# EAGLE board SBC_65C02_IRQ_BigBoard_v9-1-3 (EAGLE 9.6.2), part 1 of 2
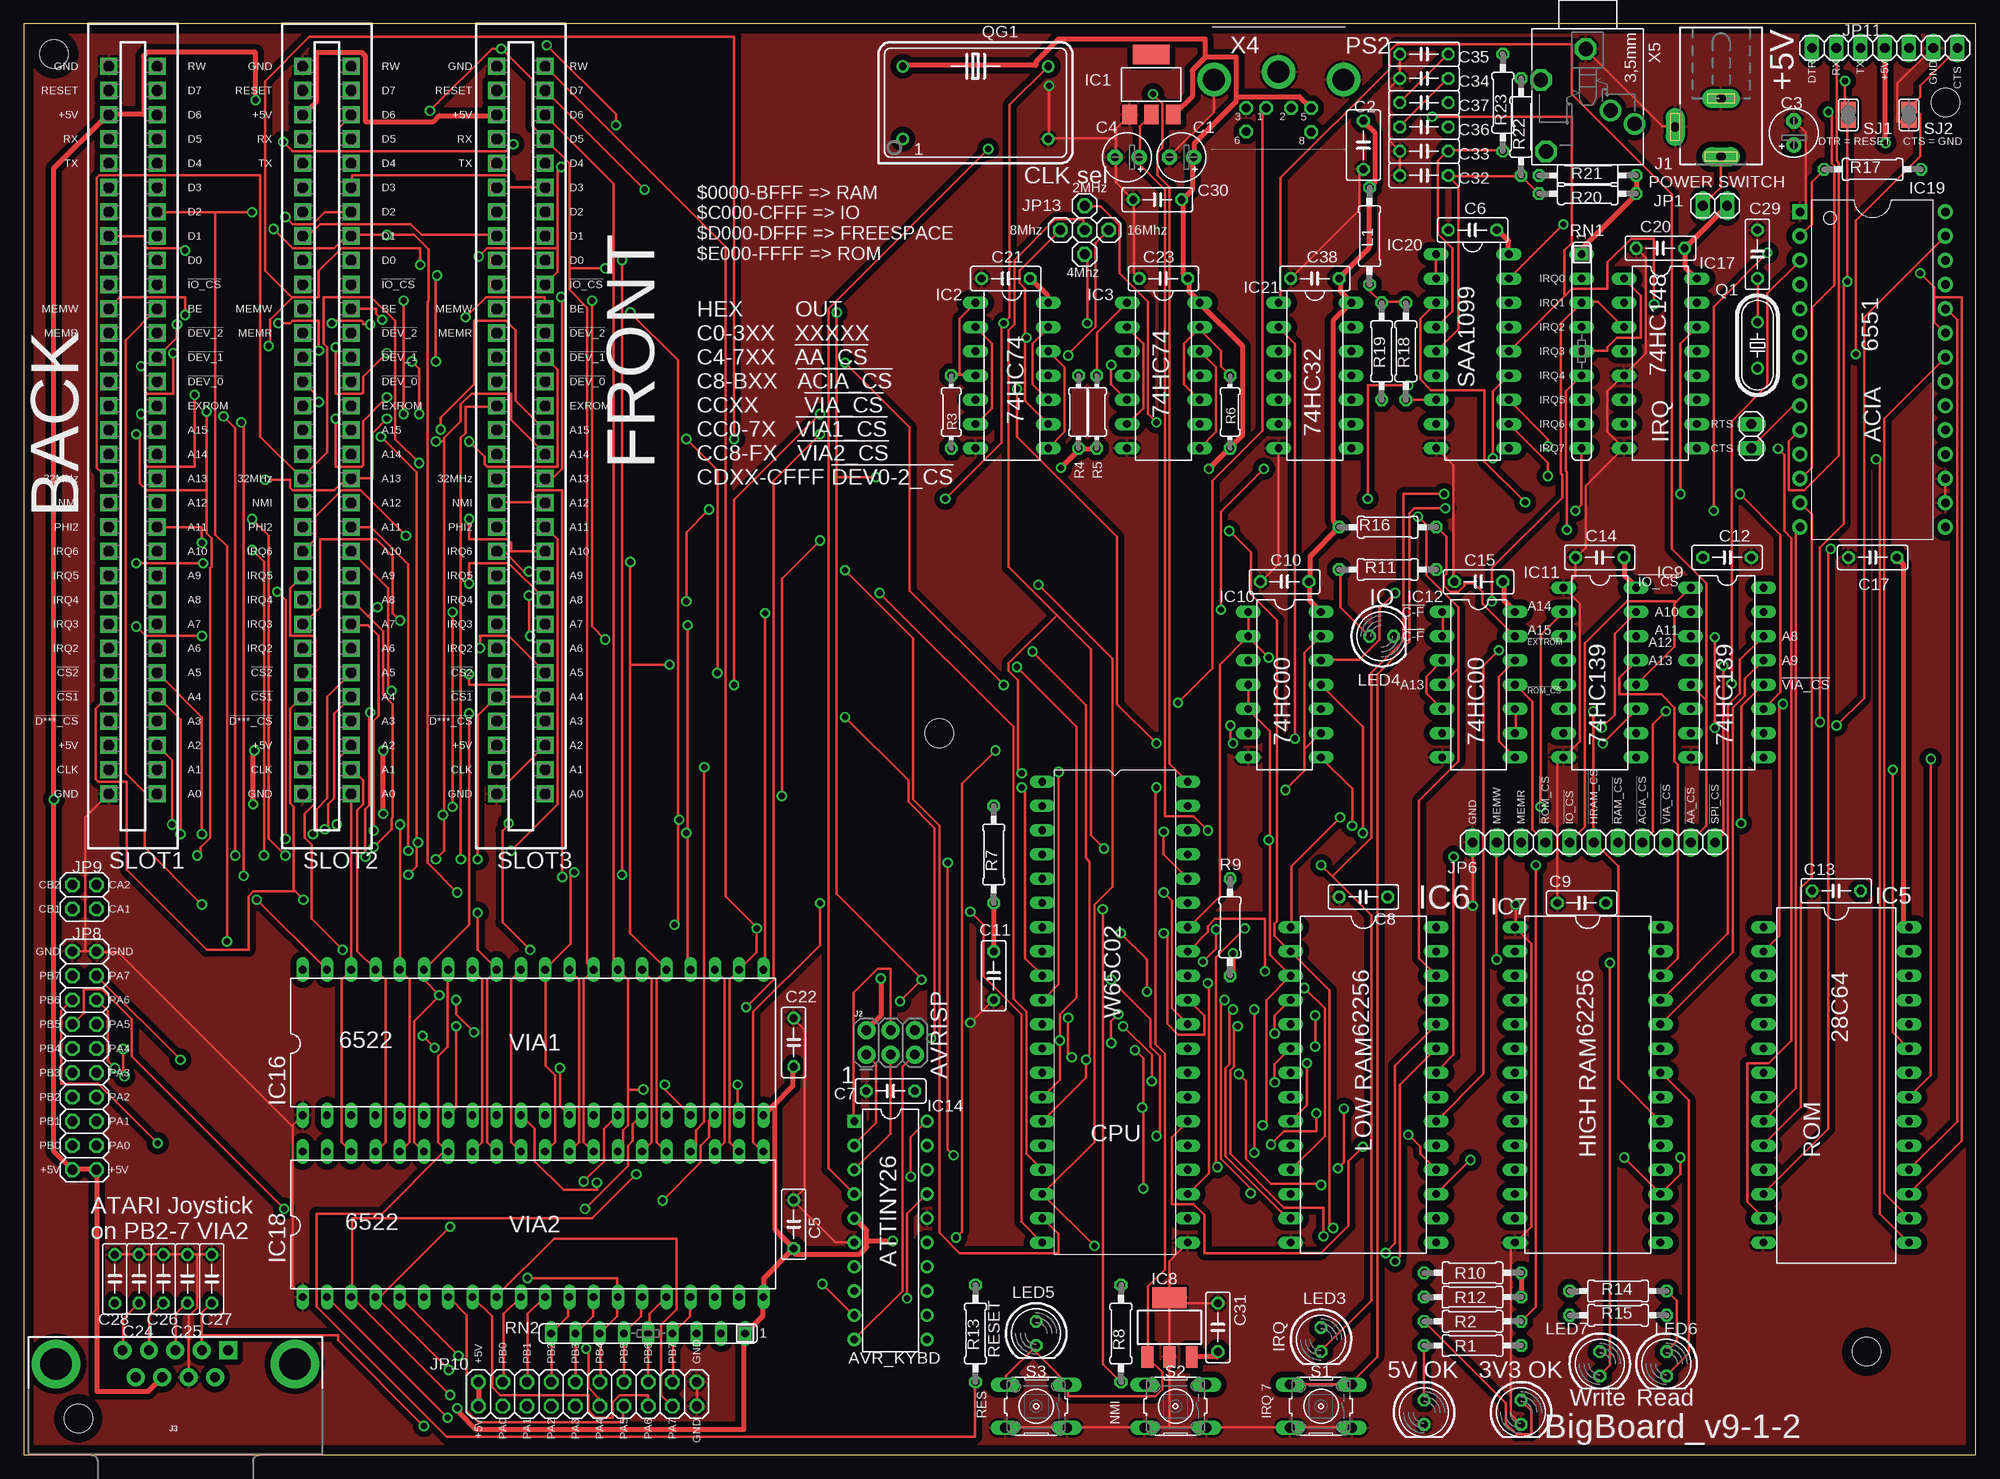
[diagram p7: board, top side]
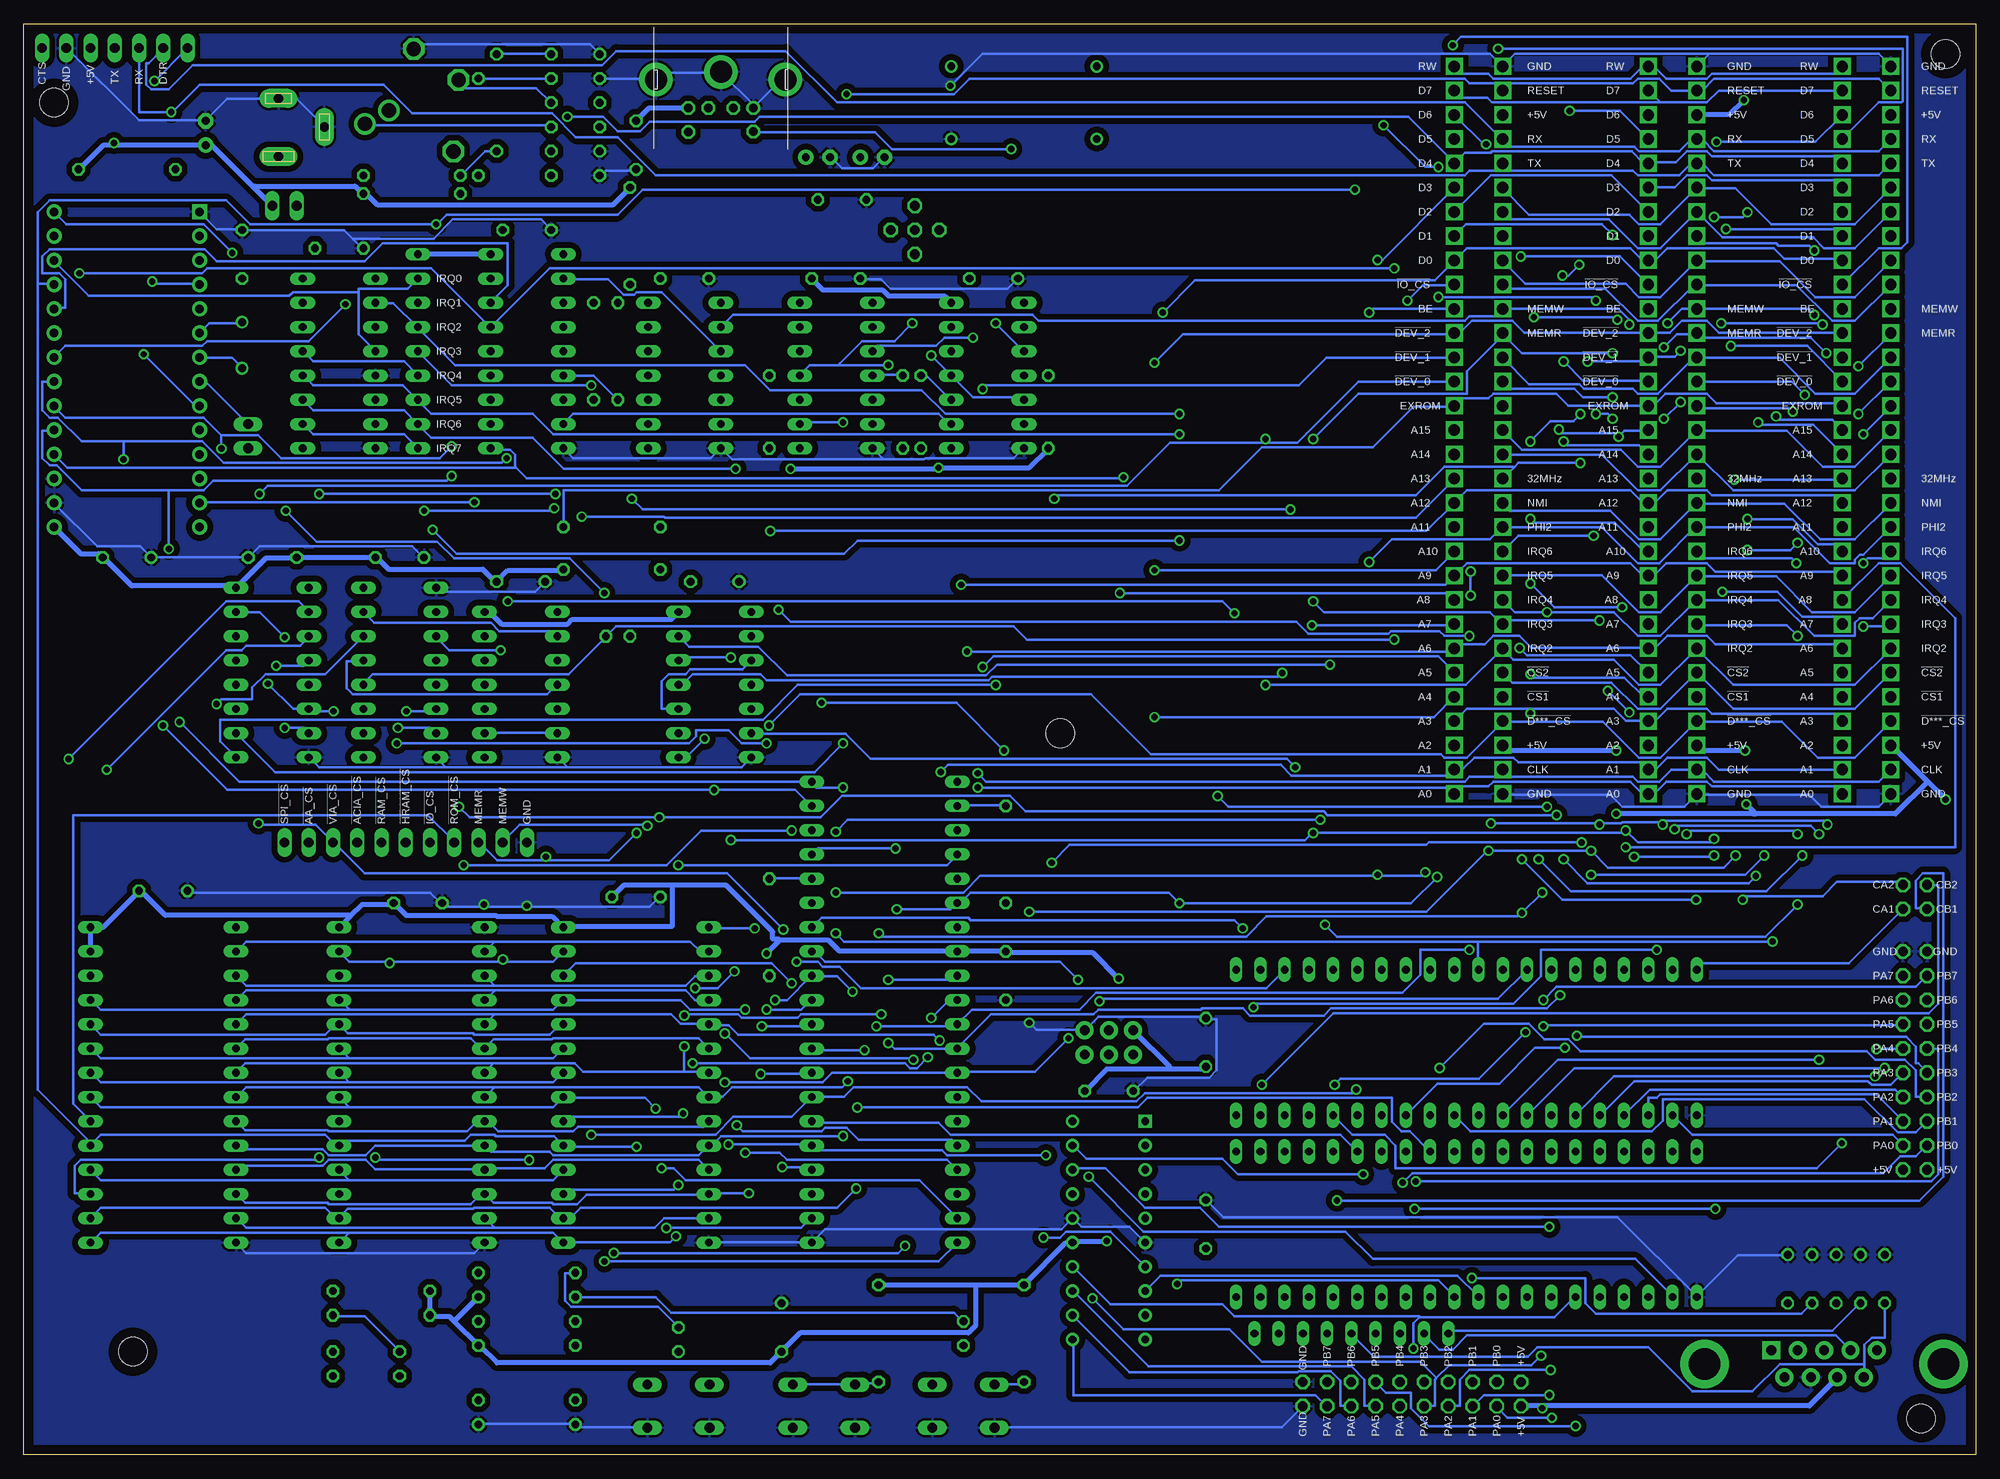
[diagram p8: board, bottom side, seen from below]

Size 204.47 x 149.86 mm. Coordinates in mm from the lower left corner, seen from the top.
Outline: 0,149.86 0,0 204.47,0 204.47,149.86 0,149.86
Copper layers (1*16): Top 0.035mm / dielectric 1.5mm / Bottom 0.035mm
Design rules "default": minimum track width 6mil, minimum drill 0.35mm, track to track 6mil, track to pad 6mil, pad to pad 6mil, via to via 6mil, smd to smd 6mil, copper to edge 40mil, drill to drill 6mil, minimum pad ring 10mil, minimum via ring 8mil, stop-mask expansion 4mil, vias tented up to drill 0mil, thermal gap 10mil
Net classes: 0 default: width 0.254 mm, drill 0.66 mm, clearance 0.203 mm; 1 power: width 0.508 mm, drill 0.66 mm, clearance 0.254 mm to class 0, clearance 0.254 mm
Holes 3 mm at 3.17,146.69 201.3,141.6 193.04,10.8 95.89,75.56 5.72,3.81
vRestrict: area 160.7,0.6 to 187.3,7

## Footprints (pad centres in the part's own frame; a part is rotated, then mirrored left to right if it is on the bottom)
E2,5-5 = drill 0.813 pad 1.6: + -1.27,0 | drill 0.813 pad 1.6 octagon: - 1.27,0
C050-035X075 = drill 0.813 octagon: 1 -2.54,0; 2 2.54,0
C050-025X075 = drill 0.813 octagon: 1 -2.54,0; 2 2.54,0
SOT223 = smd 1.499 x 2.007: 1 -2.261,-3.15; 2 0.025,-3.15; 3 2.311,-3.15 | smd 3.81 x 2.007: 4 0,3.15
DIL14 = drill 0.813 long: 1 -7.62,-3.81; 2 -5.08,-3.81; 3 -2.54,-3.81; 4 0,-3.81; 5 2.54,-3.81; 6 5.08,-3.81; 7 7.62,-3.81; 8 7.62,3.81; 9 5.08,3.81; 10 2.54,3.81; 11 0,3.81; 12 -2.54,3.81; 13 -5.08,3.81; 14 -7.62,3.81
DIL40 = drill 0.8 long: 1 -7.62,20.32; 2 -7.62,17.78; 3 -7.62,15.24; 4 -7.62,12.7; 5 -7.62,10.16; 6 -7.62,7.62; 7 -7.62,5.08; 8 -7.62,2.54; 9 -7.62,0; 10 -7.62,-2.54; 11 -7.62,-5.08; 12 -7.62,-7.62; 13 -7.62,-10.16; 14 -7.62,-12.7; 15 -7.62,-15.24; 16 -7.62,-17.78; 17 -7.62,-20.32; 18 -7.62,-22.86; 19 -7.62,-25.4; 20 -7.62,-27.94; 21 7.62,-27.94; 22 7.62,-25.4; 23 7.62,-22.86; 24 7.62,-20.32; 25 7.62,-17.78; 26 7.62,-15.24; 27 7.62,-12.7; 28 7.62,-10.16; 29 7.62,-7.62; 30 7.62,-5.08; 31 7.62,-2.54; 32 7.62,0; 33 7.62,2.54; 34 7.62,5.08; 35 7.62,7.62; 36 7.62,10.16; 37 7.62,12.7; 38 7.62,15.24; 39 7.62,17.78; 40 7.62,20.32
DIL28-6 = drill 0.813 long: 1 -16.51,-7.62; 2 -13.97,-7.62; 3 -11.43,-7.62; 4 -8.89,-7.62; 5 -6.35,-7.62; 6 -3.81,-7.62; 7 -1.27,-7.62; 8 1.27,-7.62; 9 3.81,-7.62; 10 6.35,-7.62; 11 8.89,-7.62; 12 11.43,-7.62; 13 13.97,-7.62; 14 16.51,-7.62; 15 16.51,7.62; 16 13.97,7.62; 17 11.43,7.62; 18 8.89,7.62; 19 6.35,7.62; 20 3.81,7.62; 21 1.27,7.62; 22 -1.27,7.62; 23 -3.81,7.62; 24 -6.35,7.62; 25 -8.89,7.62; 26 -11.43,7.62; 27 -13.97,7.62; 28 -16.51,7.62
SOT223' = smd 1.219 x 2.235: 1 -2.311,-3.099; 2 0,-3.099; 3 2.311,-3.099 | smd 3.6 x 2.2: 4 0,3.099
DIL16 = drill 0.813 long: 1 -8.89,-3.81; 2 -6.35,-3.81; 3 -3.81,-3.81; 4 -1.27,-3.81; 5 1.27,-3.81; 6 3.81,-3.81; 7 6.35,-3.81; 8 8.89,-3.81; 9 8.89,3.81; 10 6.35,3.81; 11 3.81,3.81; 12 1.27,3.81; 13 -1.27,3.81; 14 -3.81,3.81; 15 -6.35,3.81; 16 -8.89,3.81
DIL20 = drill 0.8 pad 1.4 square: 1 -11.43,-3.81 | drill 0.8 pad 1.4: 2 -8.89,-3.81; 3 -6.35,-3.81; 4 -3.81,-3.81; 5 -1.27,-3.81; 6 1.27,-3.81; 7 3.81,-3.81; 8 6.35,-3.81; 9 8.89,-3.81; 10 11.43,-3.81; 11 11.43,3.81; 12 8.89,3.81; 13 6.35,3.81; 14 3.81,3.81; 15 1.27,3.81; 16 -1.27,3.81; 17 -3.81,3.81; 18 -6.35,3.81; 19 -8.89,3.81; 20 -11.43,3.81
DIL40' = drill 0.813 long: 1 -24.13,-7.62; 2 -21.59,-7.62; 3 -19.05,-7.62; 4 -16.51,-7.62; 5 -13.97,-7.62; 6 -11.43,-7.62; 7 -8.89,-7.62; 8 -6.35,-7.62; 9 -3.81,-7.62; 10 -1.27,-7.62; 11 1.27,-7.62; 12 3.81,-7.62; 13 6.35,-7.62; 14 8.89,-7.62; 15 11.43,-7.62; 16 13.97,-7.62; 17 16.51,-7.62; 18 19.05,-7.62; 19 21.59,-7.62; 20 24.13,-7.62; 21 24.13,7.62; 22 21.59,7.62; 23 19.05,7.62; 24 16.51,7.62; 25 13.97,7.62; 26 11.43,7.62; 27 8.89,7.62; 28 6.35,7.62; 29 3.81,7.62; 30 1.27,7.62; 31 -1.27,7.62; 32 -3.81,7.62; 33 -6.35,7.62; 34 -8.89,7.62; 35 -11.43,7.62; 36 -13.97,7.62; 37 -16.51,7.62; 38 -19.05,7.62; 39 -21.59,7.62; 40 -24.13,7.62
DIP-28 = drill 0.889 pad 1.6 square: 1 -15.24,-7.62 | drill 0.889 pad 1.6: 2 -12.7,-7.62; 3 -10.16,-7.62; 4 -7.62,-7.62; 5 -5.08,-7.62; 6 -2.54,-7.62; 7 0,-7.62; 8 2.54,-7.62; 9 5.08,-7.62; 10 7.62,-7.62; 11 10.16,-7.62; 12 12.7,-7.62; 13 15.24,-7.62; 14 17.78,-7.62; 15 17.78,7.62; 16 15.24,7.62; 17 12.7,7.62; 18 10.16,7.62; 19 7.62,7.62; 20 5.08,7.62; 21 2.54,7.62; 22 0,7.62; 23 -2.54,7.62; 24 -5.08,7.62; 25 -7.62,7.62; 26 -10.16,7.62; 27 -12.7,7.62; 28 -15.24,7.62
DIL18 = drill 0.813 long: 1 -10.16,-3.81; 2 -7.62,-3.81; 3 -5.08,-3.81; 4 -2.54,-3.81; 5 0,-3.81; 6 2.54,-3.81; 7 5.08,-3.81; 8 7.62,-3.81; 9 10.16,-3.81; 10 10.16,3.81; 11 7.62,3.81; 12 5.08,3.81; 13 2.54,3.81; 14 0,3.81; 15 -2.54,3.81; 16 -5.08,3.81; 17 -7.62,3.81; 18 -10.16,3.81
DCJ0202 = drill 1 pad 2 long: 1 0,3.1; 2 4.8,0; 3 0,-3
2X3-NS = drill 1.016 pad 1.88: 1 -2.54,-1.27; 2 -2.54,1.27; 3 0,-1.27; 4 0,1.27; 5 2.54,-1.27; 6 2.54,1.27
DB9_MALE = drill 1.016 pad 1.88: 1 5.54,-1.42; 2 2.77,-1.42; 3 0,-1.42; 4 -2.77,-1.42; 6 4.15,1.42; 7 1.38,1.42; 8 -1.38,1.42; 9 -4.15,1.42 | drill 1.016 pad 1.88 square: 5 -5.54,-1.42 | drill 3.302 pad 5.08: G1 -12.5,0; G2 12.5,0
1X02 = drill 1.016 long: 1 -1.27,0; 2 1.27,0
1X01 = drill 1.016 octagon: 1 0,0
1X11 = drill 1.016 long: 1 -12.7,0; 2 -10.16,0; 3 -7.62,0; 4 -5.08,0; 5 -2.54,0; 6 0,0; 7 2.54,0; 8 5.08,0; 9 7.62,0; 10 10.16,0; 11 12.7,0
2X10 = drill 1.016 octagon: 1 -11.43,-1.27; 2 -11.43,1.27; 3 -8.89,-1.27; 4 -8.89,1.27; 5 -6.35,-1.27; 6 -6.35,1.27; 7 -3.81,-1.27; 8 -3.81,1.27; 9 -1.27,-1.27; 10 -1.27,1.27; 11 1.27,-1.27; 12 1.27,1.27; 13 3.81,-1.27; 14 3.81,1.27; 15 6.35,-1.27; 16 6.35,1.27; 17 8.89,-1.27; 18 8.89,1.27; 19 11.43,-1.27; 20 11.43,1.27
2X02 = drill 1.016 octagon: 1 -1.27,-1.27; 2 -1.27,1.27; 3 1.27,-1.27; 4 1.27,1.27
1X07 = drill 1.016 long: 1 -7.62,0; 2 -5.08,0; 3 -2.54,0; 4 0,0; 5 2.54,0; 6 5.08,0; 7 7.62,0
0207/10 = drill 0.813 octagon: 1 -5.08,0; 2 5.08,0
LED5MM = drill 0.813 octagon: A -1.27,0; K 1.27,0
HC49/S = drill 0.813: 1 -2.413,0; 2 2.413,0
DIL14S = drill 0.813: 1 -7.62,-3.81; 7 7.62,-3.81; 8 7.62,3.81; 14 -7.62,3.81
0204/7 = drill 0.813 octagon: 1 -3.81,0; 2 3.81,0
SIL9 = drill 0.813 long: 1 -10.16,0; 2 -7.62,0; 3 -5.08,0; 4 -2.54,0; 5 0,0; 6 2.54,0; 7 5.08,0; 8 7.62,0; 9 10.16,0
B3F-10XX = drill 1.016 long: 1 -3.251,2.261; 2 3.251,2.261; 3 -3.251,-2.261; 4 3.251,-2.261
SJ = smd 1.168 x 1.6: 1 -0.762,0; 2 0.762,0
ISA-8 = drill 1.2 pad 1.778 square: A1 40.64,-2.54; A2 38.1,-2.54; A3 35.56,-2.54; A4 33.02,-2.54; A5 30.48,-2.54; A6 27.94,-2.54; A7 25.4,-2.54; A8 22.86,-2.54; A9 20.32,-2.54; A10 17.78,-2.54; A11 15.24,-2.54; A12 12.7,-2.54; A13 10.16,-2.54; A14 7.62,-2.54; A15 5.08,-2.54; A16 2.54,-2.54; A17 0,-2.54; A18 -2.54,-2.54; A19 -5.08,-2.54; A20 -7.62,-2.54; A21 -10.16,-2.54; A22 -12.7,-2.54; A23 -15.24,-2.54; A24 -17.78,-2.54; A25 -20.32,-2.54; A26 -22.86,-2.54; A27 -25.4,-2.54; A28 -27.94,-2.54; A29 -30.48,-2.54; A30 -33.02,-2.54; A31 -35.56,-2.54; B1 40.64,2.54; B2 38.1,2.54; B3 35.56,2.54; B4 33.02,2.54; B5 30.48,2.54; B6 27.94,2.54; B7 25.4,2.54; B8 22.86,2.54; B9 20.32,2.54; B10 17.78,2.54; B11 15.24,2.54; B12 12.7,2.54; B13 10.16,2.54; B14 7.62,2.54; B15 5.08,2.54; B16 2.54,2.54; B17 0,2.54; B18 -2.54,2.54; B19 -5.08,2.54; B20 -7.62,2.54; B21 -10.16,2.54; B22 -12.7,2.54; B23 -15.24,2.54; B24 -17.78,2.54; B25 -20.32,2.54; B26 -22.86,2.54; B27 -25.4,2.54; B28 -27.94,2.54; B29 -30.48,2.54; B30 -33.02,2.54; B31 -35.56,2.54
M_DIN6 = drill 0.9 pad 1.422 octagon: 1 -1.3,-3.75; 2 1.3,-3.75; 3 -3.4,-3.75; 5 3.4,-3.75; 6 -3.4,-6.2; 8 3.4,-6.25 | drill 2.3 pad 3.5: SH1 6.8,-0.75; SH2 0,0.05; SH3 -6.75,-0.75
PG203J = drill 1.499 octagon: 1 -5.004,-0.203; 4 5.74,-4.369; 5 -1.753,-4.902 | drill 1.499: 2 2.845,4.902; 3 1.448,2.388

## Placement (x,y rotation side)
C1  10uF  [E2,5-5]  121.28,135.89 180 top
C2  [C050-035X075]  140.34,137.16 270 top
C3  [E2,5-5]  185.42,138.43 90 top
C4  100uF  [E2,5-5]  115.57,135.89 180 top
C5  [C050-025X075]  80.64,24.13 90 top
C6  [C050-025X075]  151.76,128.27 180 top
C7  [C050-025X075]  90.81,38.1 180 top
C8  [C050-025X075]  140.34,58.42 180 top
C9  [C050-025X075]  163.19,57.78 0 top
C10  [C050-025X075]  132.08,91.44 180 top
C11  [C050-025X075]  101.6,50.17 270 top
C12  [C050-025X075]  178.44,93.98 0 top
C13  [C050-025X075]  189.87,59.06 180 top
C14  [C050-025X075]  165.1,93.98 180 top
C15  [C050-025X075]  152.4,91.44 180 top
C17  [C050-025X075]  193.68,93.98 0 top
C20  [C050-025X075]  171.45,126.37 180 top
C21  [C050-025X075]  102.87,123.19 180 top
C22  [C050-025X075]  80.64,43.18 90 top
C23  [C050-025X075]  119.38,123.19 180 top
C24  1n  [C050-025X075]  12.06,18.41 270 top
C25  1n  [C050-025X075]  17.14,18.41 90 top
C26  1n  [C050-025X075]  14.61,18.41 270 top
C27  1n  [C050-025X075]  19.69,18.41 90 top
C28  1n  [C050-025X075]  9.53,18.41 270 top
C29  [C050-025X075]  181.61,125.73 270 top
C30  [C050-025X075]  118.75,131.44 0 top
C31  [C050-025X075]  125.09,13.34 270 top
C32  10n  [C050-025X075]  146.69,133.99 0 top
C33  10n  [C050-025X075]  146.69,136.53 0 top
C34  10n  [C050-025X075]  146.69,144.15 0 top
C35  10n  [C050-025X075]  146.69,146.69 0 top
C36  100n  [C050-025X075]  146.69,139.06 0 top
C37  100n  [C050-025X075]  146.69,141.6 0 top
C38  [C050-025X075]  135.25,123.19 180 top
IC1  REG1117_3V3  [SOT223]  118.11,143.51 0 top
IC2  74HC74N  [DIL14]  103.5,113.03 270 top
IC3  74HC74N  [DIL14]  119.38,113.03 270 top
IC4  W65C02SP  [DIL40]  114.3,50.17 0 top
IC5  28C64AP  [DIL28-6]  189.87,38.73 270 top
IC6  62256  [DIL28-6]  140.34,38.73 270 top
IC7  62256  [DIL28-6]  163.83,38.73 270 top
IC8  DS1233  [SOT223']  120.02,13.34 0 top
IC9  74HCT139N  [DIL16]  178.44,81.92 270 top
IC10  74AC00N  [DIL14]  132.08,80.64 270 top
IC11  74HCT139N  [DIL16]  165.1,81.92 270 top
IC12  74AC00N  [DIL14]  152.4,80.64 270 top
IC14  ATTINY26-16PU  [DIL20]  90.81,23.49 270 top
IC16  [DIL40']  53.34,43.18 0 top
IC17  74HC148N  [DIL16]  171.45,114.3 270 top
IC18  [DIL40']  53.34,24.13 0 top
IC19  R6551  [DIP-28]  193.68,114.94 270 top
IC20  SAA  [DIL18]  151.76,115.57 270 top
IC21  74AC32N  [DIL14]  135.25,113.03 270 top
J1  DCJ0202  [DCJ0202]  177.8,139.06 180 top
J2  AVR_SPI_PROG_3X2NS  [2X3-NS]  90.81,43.18 0 top
J3  [DB9_MALE]  15.88,9.52 180 top
JP1  [1X02]  177.17,130.81 0 top
JP2  [1X01]  113.66,128.27 0 top
JP3  [1X01]  108.59,128.27 0 top
JP4  [1X01]  111.12,125.73 0 top
JP5  [1X01]  111.12,130.81 0 top
JP6  [1X11]  164.47,64.14 0 top
JP8  Parallel  [2X10]  6.35,41.27 90 top
JP9  Timer_OUT  [2X02]  6.35,58.42 90 top
JP10  Parallel2  [2X10]  59.05,6.35 0 top
JP11  [1X07]  194.94,147.32 0 top
JP12  [1X02]  180.97,106.68 270 top
JP13  [1X01]  111.12,128.27 0 top
L1  [0207/10]  140.97,127.63 270 top
LED1  [LED5MM]  146.69,4.45 270 top
LED2  [LED5MM]  156.84,4.45 270 top
LED3  [LED5MM]  135.89,12.07 270 top
LED4  [LED5MM]  142.24,85.72 0 top
LED5  [LED5MM]  106.05,12.7 270 top
LED6  [LED5MM]  172.09,9.52 270 top
LED7  [LED5MM]  165.1,9.52 270 top
Q1  1,8432MHz  [HC49/S]  181.61,116.21 270 top
QG1  32Mhz  [DIL14S]  99.69,141.6 0 top
R1  680R  [0207/10]  151.76,11.43 0 top
R2  470R  [0207/10]  151.76,13.97 0 top
R3  4k7  [0204/7]  97.16,109.22 90 top
R4  4k7  [0204/7]  110.49,109.22 90 top
R5  4k7  [0204/7]  112.39,109.22 90 top
R6  4k7  [0204/7]  126.37,109.22 90 top
R7  22k  [0207/10]  101.6,62.86 90 top
R8  22k  [0207/10]  114.94,12.7 270 top
R9  22k  [0207/10]  126.37,55.25 90 top
R10  680R  [0207/10]  151.76,19.05 0 top
R11  680R  [0207/10]  142.88,92.71 0 top
R12  680R  [0207/10]  151.76,16.51 0 top
R13  22k  [0207/10]  99.69,12.7 270 top
R14  680R  [0207/10]  167,17.15 0 top
R15  680R  [0207/10]  167,14.61 0 top
R16  22K  [0207/10]  142.88,97.16 180 top
R17  22k  [0207/10]  193.68,134.62 0 top
R18  22k  [0207/10]  144.78,115.57 90 top
R19  22k  [0207/10]  142.24,115.57 90 top
R20  1k  [0207/10]  163.83,132.08 180 top
R21  1k  [0207/10]  163.83,133.99 180 top
R22  1k  [0207/10]  156.84,139.06 90 top
R23  1k  [0207/10]  154.94,141.6 90 top
RN1  22k  [SIL9]  163.19,115.57 270 top
RN2  22k  [SIL9]  65.41,12.7 180 top
S1  [B3F-10XX]  135.89,5.08 180 top
S2  [B3F-10XX]  120.65,5.08 180 top
S3  [B3F-10XX]  106.05,5.08 180 top
SJ1  [SJ]  191.13,140.34 90 top
SJ2  [SJ]  197.49,140.34 90 top
X1  [ISA-8]  11.43,104.78 90 top
X2  [ISA-8]  31.75,104.78 90 top
X3  [ISA-8]  52.07,104.78 90 top
X4  [M_DIN6]  131.44,144.78 0 top
X5  PG203J  [PG203J]  163.83,142.24 270 top

## Tracks (layer width: path | path; a pad name or v marks a point on that pad's centre or on a via)
2MHZ  (via drill 0.66)
  Top 0.254: v118.66,108.12 117.78,109 117.78,120.75 114.78,123.75 114.78,128.75 112.78,130.75 111.16,130.75 JP5.1
  Bottom 0.254: v118.66,108.12 123.03,108.12 123.16,108 IC3.9
2PA0  (via drill 0.66)
  Top 0.254: v44.41,3.88 31.78,16.5 IC18.2 | v92.91,29.12 92.91,33.25 94.53,34.88 IC14.20
  Bottom 0.254: v44.41,3.88 49.03,3.88 50.16,5 JP10.3 | v92.91,29.12 87.16,23.38 66.03,23.38 63.16,20.5 35.66,20.5 31.78,16.62 IC18.2
2PA1  (via drill 0.66)
  Top 0.254: v44.66,6.25 34.41,16.5 IC18.3 34.41,16.62 34.41,24.75 59.53,24.75 v64.16,29.38
  Bottom 0.254: v44.66,6.25 51.53,6.25 52.66,5.12 JP10.5 | v64.16,29.38 77.28,29.38 78.91,31 93.16,31 94.53,32.38 IC14.19
2PA2  (via drill 0.66)
  Top 0.254: v44.53,8.88 36.91,16.5 IC18.4 37.16,16.38 v44.66,23.88
  Bottom 0.254: v44.53,8.88 53.03,8.88 54.03,7.88 54.03,5.12 55.16,5.12 JP10.7 | v44.66,23.88 79.28,23.88 81.28,25.88 87.03,25.88 91.16,30 94.41,30 94.53,29.88 IC14.18
2PA3  (via drill 0.66)
  Top 0.254: v45.53,10.38 39.41,16.5 IC18.5 | v92.53,16.38 92.53,25.25 94.53,27.25 IC14.17
  Bottom 0.254: v45.53,10.38 46.53,9.38 55.16,9.38 56.47,8.06 | 56.47,8.06 56.66,7.88 56.66,5.12 57.78,5.12 JP10.9 | v92.53,16.38 89.28,13.12 78.16,13.12 74.78,9.75 58.16,9.75 56.47,8.06
2PA4  (via drill 0.66)
  Top 0.254: v58.91,11.12 59.16,10.88 59.16,7 60.28,5.88 60.28,5.12 JP10.11
  Bottom 0.254: 58.28,14.38 44.16,14.38 42.03,16.5 IC18.6 | 58.28,14.38 58.91,13.75 v58.91,11.12 | IC14.14 94.53,19.62 90.66,15.75 78.91,15.75 77.66,14.5 58.28,14.5 58.28,14.38
2PA5
  Top 0.254: IC18.7 44.53,16.5 46.41,14.62 46.41,4.62 47.66,3.38 62.78,3.38 62.78,5 JP10.13
  Bottom 0.254: IC14.13 94.53,17.12 86.66,9.25 65.41,9.25 64.03,7.88 64.03,5.12 62.91,5.12 JP10.13
2PA6
  Top 0.254: JP10.15 65.41,6.25 62.41,6.25 61.66,5.5 61.66,3.88 59.91,3.88 59.16,4.62 59.16,6.25 49.91,6.25 49.03,7.12 49.03,14.5 47.03,16.5 IC18.8
  Bottom 0.254: IC14.12 94.53,14.5 88.66,8.62 71.03,8.62 70.91,8.75 67.53,8.75 66.53,7.75 66.53,5.12 65.41,5.12 JP10.15
2PA7
  Top 0.254: IC18.9 49.53,16.62 55.53,22.62 68.41,22.62 68.41,15.25 66.78,13.62 66.78,6.25 67.91,5.12 JP10.17
  Bottom 0.254: IC14.11 94.53,12 94.53,6.25 69.16,6.25 68.03,5.12 JP10.17
2PB0
  Top 0.254: IC18.10 52.03,16.5 50.28,14.75 50.28,7.62 JP10.4
  Bottom 0.254: IC14.8 86.91,17.25 85.41,18.75 54.28,18.75 52.16,16.62 IC18.10
2PB1  (via drill 0.66)
  Top 0.254: IC18.11 54.53,16.5 52.78,14.75 52.78,7.62 JP10.6 | v83.66,17.88 86.91,14.62 IC14.9
  Bottom 0.254: v83.66,17.88 83.28,18.25 56.28,18.25 54.66,16.62 IC18.11
2PB2
  Top 0.254: C24.2 12.03,15.88 10.41,14.25 10.41,11 J3.1 | IC18.12 57.03,16.5 57.03,14.5 55.28,12.75 RN2.9 55.28,12.62 55.28,7.62 JP10.8
  Bottom 0.254: C24.2 12.16,15.88 15.03,13 54.91,13 55.16,12.75 RN2.9
2PB3
  Top 0.254: C26.2 14.53,15.88 13.16,14.5 13.16,11 J3.2 | IC18.13 59.66,16.5 59.66,14.5 57.91,12.75 RN2.8 57.78,12.62 JP10.10
  Bottom 0.254: J3.2 13.16,11 14.66,12.5 53.28,12.5 54.78,11 56.16,11 57.78,12.62 RN2.8
2PB4  (via drill 0.66)
  Top 0.254: C25.1 17.03,15.88 15.91,14.75 15.91,11 J3.3 | JP10.12 60.41,7.62 60.41,12.62 RN2.7 60.41,12.75 62.16,14.5 62.16,16.5 IC18.14 62.16,16.62 62.16,18.5 v52.78,18.5
  Bottom 0.254: v52.78,18.5 40.91,18.5 40.91,15.88 39.78,14.75 18.28,14.75 17.16,15.88 C25.1
2PB5  (via drill 0.66)
  Top 0.254: 18.66,12.5 18.66,11 J3.4 | 18.66,12.5 18.66,14.88 19.66,15.88 C27.1 | IC18.15 64.66,16.5 64.66,14.5 62.91,12.75 RN2.6 62.91,12.62 62.91,7.62 JP10.14 | 18.66,12.5 32.91,12.5 32.91,12 v41.91,3
  Bottom 0.254: v41.91,3 57.28,3 59.16,4.88 59.16,6.5 61.78,6.5 62.78,7.5 JP10.14
2PB6
  Top 0.254: JP10.16 RN2.5 65.53,12.75 65.53,14.75 67.28,16.5 IC18.16
  Bottom 0.254: 11.66,9.5 11.66,8.12 J3.6 | 11.66,9.5 11.66,11.5 10.91,12.25 9.53,12.25 C28.2 | 11.66,9.5 20.53,9.5 23.41,6.62 29.66,6.62 34.28,11.25 45.91,11.25 46.91,10.25 63.03,10.25 65.41,12.62 RN2.5
2PB7
  Top 0.254: IC18.17 69.78,16.5 69.78,14.5 68.03,12.75 RN2.4 68.03,12.62 68.03,7.62 JP10.18
4MHZ  (via drill 0.66)
  Top 0.254: v113.91,114.12 113.91,112.12 115.53,110.5 IC3.5 | v111.41,118.5 111.41,125.38 111.16,125.62 JP4.1
  Bottom 0.254: 119.03,114.12 122.16,114.12 123.16,113.12 IC3.11 | 119.03,114.12 v113.91,114.12 | v111.41,118.5 113.28,116.62 116.66,116.62 119.03,114.25 119.03,114.12
8MHZ  (via drill 0.66)
  Top 0.254: 104.91,117 104.91,122.12 104.28,122.75 104.28,124 108.53,128.25 JP3.1 | 104.91,117 104.91,110.38 107.28,108 IC2.9 | v105.03,117 104.91,117
  Bottom 0.254: IC20.8 146.91,109 108.66,109 107.66,108 107.41,108 IC2.9 | v105.03,117 108.03,117 108.91,116.12 115.03,116.12 115.53,115.62 IC3.3
16MHZ  (via drill 0.66)
  Top 0.254: v109.41,115.12 109.41,115.25 112.28,118.12 112.28,126.88 113.66,128.25 JP2.1
  Bottom 0.254: IC2.5 99.78,110.5 100.03,110.75 105.03,110.75 107.28,113 IC2.11 107.41,113.12 v109.41,115.12
32MHZ  (via drill 0.66)
  Top 0.254: QG1.8 107.28,145.38 103.28,141.38 103.28,119.12 v102.66,118.5 102.66,118.38 102.41,118.12 102.41,106 v96.53,100.12 | X1.B18 8.78,102.25 7.66,103.38 7.66,133.75 7.91,134 24.78,134 24.78,106.62 29.16,102.25 X2.B18 29.16,102.38 31.78,105 31.78,116 31.41,116.38 31.41,121.25 36.41,121.25 38.91,118.75 38.91,106.38 v41.41,103.88
  Bottom 0.254: v102.66,118.5 99.78,115.62 IC2.3 | 48.34,103.44 47.91,103.88 v41.41,103.88 | 48.34,103.44 49.53,102.25 X3.B18 | v96.53,100.12 96.16,100.5 58.66,100.5 55.66,103.5 48.41,103.5 48.34,103.44
!A7  (via drill 0.66)
  Top 0.254: v71.28,72 71.28,34.88 70.41,34 70.41,32.25 69.91,31.75 IC18.24
  Bottom 0.254: v71.28,72 72.16,72.88 115.78,72.88 118.41,75.5 128.16,75.5 IC10.6
!AA_CS
  Top 0.254: 176.22,79.06 176.28,79 176.28,65.88 174.66,64.25 JP6.10 | 176.22,79.06 174.66,80.62 IC9.5 | IC21.1 131.53,120.75 131.66,120.88 131.66,133.75 143.03,145.12 143.03,147 143.78,147.75 162.16,147.75 162.16,142.5 172.66,132 172.66,94.88 176.28,91.25 176.28,79.12 176.22,79.06
!AA_CS_WR
  Top 0.254: IC20.1 147.91,125.62 147.91,123.25 IC20.2
  Bottom 0.254: IC21.3 131.53,115.62 137.66,121.75 140.28,121.75 140.53,121.5 141.66,121.5 143.28,123.12 147.91,123.12 IC20.2
!ACIA_CS  (via drill 0.66)
  Top 0.254: v172.03,77.88 170.66,76.5 170.66,65.25 169.66,64.25 JP6.8 | v178.91,80.75 178.91,108.25 182.66,112 182.66,121.62 186.03,125 IC19.3
  Bottom 0.254: v172.03,77.88 174.41,77.88 174.53,78 IC9.6 174.66,78.12 176.28,78.12 v178.91,80.75
!C-F  (via drill 0.66)
  Top 0.254: IC12.2 148.66,85.75 148.66,88.25 IC12.1 | v165.28,76.12 166.66,77.5 166.66,86 168.91,88.25 IC11.15
  Bottom 0.254: v165.28,76.12 161.91,76.12 161.41,75.62 IC11.7 | IC12.2 148.66,85.75 149.16,86.25 154.66,86.25 155.53,87.12 167.78,87.12 168.91,88.25 IC11.15
!D_CS  (via drill 0.66)
  Top 0.254: v165.41,74.5 168.91,78 IC11.11 | v126.66,74.5 126.41,74.75 v126.41,76.38
  Bottom 0.254: X1.B28 8.91,76.75 12.66,73 16.53,73 20.28,76.75 29.16,76.75 X2.B28 29.28,76.75 33.03,73 35.28,73 39.03,76.75 49.41,76.75 X3.B28 49.53,76.75 53.28,73 55.66,73 56.03,73.38 86.41,73.38 92.66,79.62 123.16,79.62 v126.41,76.38 | v165.41,74.5 134.78,74.5 134.03,75.25 134.03,75.88 130.66,75.88 129.28,74.5 v126.66,74.5
!DEV0_CS  (via drill 0.66)
  Top 0.254: v25.66,116.12 25.78,116.25 25.78,118.88 28.09,121.19 | 28.09,121.19 28.16,121.25 30.91,121.25 30.91,124 33.28,126.38 41.53,126.38 v41.53,124.62 | v43.28,123.5 43.16,123.38 v43.16,114.5 | v179.78,100.62 184.03,96.38 184.03,79.88 182.28,78.12 IC9.11 | 28.09,121.19 25.28,124 25.28,143.88 29.91,148.5 74.41,148.5 v74.41,106.38
  Bottom 0.254: v25.66,116.12 17.66,116.12 14.03,112.5 X1.A14 | v41.53,124.62 42.66,123.5 v43.28,123.5 | v43.16,114.5 41.16,112.5 34.41,112.5 X2.A14 | v179.78,100.62 178.91,101.5 88.91,101.5 84.41,106 74.41,106 | 74.41,106 71.03,106 64.66,112.38 54.66,112.38 X3.A14 | 74.41,106 v74.41,106.38
!DEV1_CS  (via drill 0.66)
  Top 0.254: v16.03,118.38 16.03,117 14.03,115 X1.A13 | v26.66,118.5 27.91,118.5 28.16,118.75 30.91,118.75 v30.91,115.62 | v118.66,74.5 114.53,78.62 114.53,96.12 104.03,106.62 v104.03,111.62 | v40.66,114.5 41.41,113.75 v41.41,109 | v46.66,106.12 48.28,104.5 48.28,103.75 48.53,103.5 55.91,103.5 55.91,113.62 54.66,114.88 X3.A13
  Bottom 0.254: v16.03,118.38 16.16,118.5 v26.66,118.5 | v30.91,115.62 31.53,115 34.28,115 X2.A13 34.41,114.88 34.78,114.5 v40.66,114.5 | v118.66,74.5 121.66,71.5 178.16,71.5 182.16,75.5 IC9.10 | v104.03,111.62 103.66,112 70.91,112 68.03,114.88 54.66,114.88 X3.A13 | v41.41,109 42.16,108.25 44.53,108.25 v46.66,106.12
!DEV2_CS  (via drill 0.66)
  Top 0.254: v102.66,80.62 92.78,90.5 92.78,107.62 v86.03,114.38
  Bottom 0.254: X1.A12 14.03,117.5 26.91,117.5 28.16,118.75 30.78,118.75 32.03,117.5 34.28,117.5 X2.A12 34.41,117.5 47.28,117.5 48.53,118.75 52.78,118.75 54.03,117.5 54.53,117.5 X3.A12 54.66,117.38 83.03,117.38 v86.03,114.38 | v102.66,80.62 123.41,80.62 127.03,77 183.91,77 183.91,74.75 182.28,73.12 IC9.9
!E-F
  Top 0.254: IC12.10 156.28,78 156.28,75.62 IC12.9
  Bottom 0.254: IC12.6 148.66,75.62 156.16,75.62 IC12.9
!EXROM
  Top 0.254: IC12.13 156.16,85.75 152.78,89.12 152.78,90.38 151.91,91.25 150.91,91.25 150.91,91 150.28,90.38 149.41,90.38 148.78,91 148.78,92 149.03,92.25 149.03,96.12 148.03,97.12 R16.1
  Bottom 0.254: X1.A15 14.03,109.88 14.28,110.12 27.16,110.12 28.16,111.12 32.53,111.12 33.78,109.88 34.28,109.88 X2.A15 34.41,109.88 42.66,109.88 43.91,111.12 50.53,111.12 51.03,110.62 53.78,110.62 54.53,109.88 X3.A15 54.66,109.75 58.91,109.75 63.16,105.5 74.78,105.5 79.28,101 147.91,101 147.91,97.25 R16.1
!HRAM_CS  (via drill 0.66)
  Top 0.254: IC7.20 171.41,35 167.03,39.38 167.03,61.62 164.53,64.12 JP6.6 164.41,64.25 v164.41,77.88
  Bottom 0.254: v164.41,77.88 161.53,77.88 161.41,78 IC11.6
!IO_CS  (via drill 0.66)
  Top 0.254: 173.09,89.31 174.53,90.75 IC9.1 | 173.09,89.31 172.91,89.12 172.91,84.62 169.03,80.75 IC11.12 | JP6.5 162.03,64.25 163.53,65.75 163.53,85 167.91,89.38 173.03,89.38 173.09,89.31 | v54.78,147.62 62.03,140.38 v62.03,139.25 | v56.28,134.88 55.91,134.5 55.91,126.38 | 55.91,126.38 55.91,123.88 54.66,122.62 X3.A10 | v47.66,125.5 48.53,126.38 55.91,126.38 | v60.91,85.38 59.53,86.75 v59.53,120.88
  Bottom 0.254: IC11.12 168.91,80.75 167.91,81.75 147.41,81.75 143.53,85.62 LED4.K 143.41,85.75 142.41,86.75 100.78,86.75 99.41,85.38 v60.91,85.38 | v54.78,147.62 53.91,148.5 7.16,148.5 7.16,127 7.78,126.38 10.16,126.38 13.91,122.62 X1.A10 | v62.03,139.25 57.66,134.88 v56.28,134.88 | v47.66,125.5 37.28,125.5 34.41,122.62 X2.A10 | v59.53,120.88 57.91,122.5 54.66,122.5 X3.A10
!MEMR  (via drill 0.66)
  Top 0.254: v12.28,114 12.66,113.62 12.66,111.38 12.91,111.12 15.66,111.12 v15.66,115.38 | v38.03,115.38 35.53,112.88 35.53,111.25 35.41,111.12 32.66,111.12 v32.66,116 | v140.28,65.12 140.28,76.25 135.91,80.62 IC10.11 | LED6.K 172.16,8.38 174.41,10.62 174.41,37.12 171.53,40 IC7.22 | v149.78,62.62 149.78,41.88 148.03,40.12 IC6.22 | v69.41,106.38 72.66,103.12 v72.66,81.88
  Bottom 0.254: v12.28,114 8.91,117.38 X1.B12 | v15.66,115.38 17.28,117 28.78,117 29.16,117.38 X2.B12 29.28,117.38 31.28,117.38 v32.66,116 | v38.03,115.38 47.53,115.38 49.53,117.38 X3.B12 49.53,117.25 53.28,113.5 53.28,111.12 64.66,111.12 v69.41,106.38 | v140.28,65.12 143.16,62.25 149.78,62.25 | 149.78,62.25 154.91,62.25 156.78,64.12 JP6.3 | 170.41,39 149.03,39 148.03,40 IC6.22 | 170.41,39 171.41,40 IC7.22 | 170.41,39 196.41,39 197.41,40 IC5.22 | v149.78,62.62 149.78,62.25 | v72.66,81.88 73.03,81.5 103.03,81.5 103.41,81.12 126.66,81.12 127.28,81.75 134.41,81.75 135.41,80.75 135.78,80.75 IC10.11
!MEMW  (via drill 0.66)
  Top 0.254: v166.16,51.5 166.16,9.38 165.16,8.38 LED7.K | v16.91,119.38 16.91,121.25 10.03,121.25 8.91,120.12 X1.B11 | v36.28,118.38 35.53,118.38 35.53,118.62 35.41,118.75 32.28,118.75 v32.28,118.5 | v139.16,65.88 139.16,69.75 135.91,73 IC10.8 | v133.16,75 133.16,116.38 131.53,118 IC21.2 | v154.28,51.88 154.28,64.12 JP6.2
  Bottom 0.254: 166.16,51.62 170.41,51.62 171.41,52.62 IC7.27 | 166.16,51.62 154.28,51.62 | 154.28,51.62 149.03,51.62 148.03,52.62 IC6.27 | v166.16,51.5 166.16,51.62 | v16.91,119.38 17.53,120 29.16,120 X2.B11 29.28,120 30.78,120 v32.28,118.5 | v36.28,118.38 36.28,118.88 37.41,120 49.53,120 X3.B11 49.66,120 50.41,119.25 53.03,119.25 53.53,118.75 98.16,118.75 98.78,119.38 130.16,119.38 131.41,118.12 IC21.2 | v139.16,65.88 139.28,66 152.53,66 154.28,64.25 JP6.2 | v133.16,75 135.03,73.12 135.78,73.12 IC10.8 | v154.28,51.88 154.28,51.62
!OTHER_CS  (via drill 0.66)
  Top 0.254: v177.16,85.62 v177.16,76.12
  Bottom 0.254: v177.16,76.12 175.16,76.12 174.66,75.62 IC9.7 | v177.16,85.62 179.78,88.25 182.16,88.25 IC9.15
!ROM_CS
  Top 0.254: IC12.11 156.28,80.62 158.03,78.88 158.03,65.5 159.28,64.25 JP6.4
  Bottom 0.254: IC5.20 197.53,35 199.28,36.75 199.28,67 162.16,67 159.41,64.25 JP6.4
!SPI_CS  (via drill 0.66)
  Top 0.254: v178.03,82.62 178.03,65 JP6.11
  Bottom 0.254: v178.03,82.62 175.16,82.62 174.66,83.12 IC9.4
!VIA_CS  (via drill 0.66)
  Top 0.254: IC18.23 72.41,31.75 73.41,32.75 73.41,49.75 72.41,50.75 IC16.23 | v179.91,66.12 179.91,78.38 182.16,80.62 IC9.12 | v123.53,51.62 124.91,53 v124.91,55
  Bottom 0.254: v179.91,66.12 179.78,66 173.91,66 172.16,64.25 JP6.9 172.03,64.12 168.78,60.88 130.78,60.88 v124.91,55 | v123.53,51.62 121.28,51.62 120.78,51.12 119.03,51.12 116.78,48.88 74.28,48.88 72.41,50.75 IC16.23
+3V3  (via drill 0.66)
  Top 0.254: IC1.2 118.03,140.25 116.91,139.12 116.91,136 C4.+ 116.91,135.88 116.91,135.12 119.53,132.5 119.53,66.88 122.53,66.88 v124.03,65.38 | v158.41,61.75 158.41,15.5 156.91,14 R2.2
  Bottom 0.254: v158.41,61.75 137.16,61.75 133.53,65.38 v124.03,65.38
+5V  (via drill 0.66)
  Top 0.508: v24.28,141.88 24.28,146.88 12.91,146.88 12.53,146.5 12.53,140.38 8.91,140.38 X1.B3 8.66,140.25 3.16,134.75 v3.16,68.62 3.16,31.75 4.91,30 JP8.2 5.16,29.88 7.53,29.88 JP8.1 7.66,29.62 7.66,6.62 13.03,6.62 14.41,8 J3.7 | X3.B3 49.53,140.25 43.53,140.25 42.91,139.62 35.78,139.62 35.78,146.5 35.41,146.88 30.66,146.88 30.66,141.75 29.28,140.38 X2.B3 | JP10.1 47.66,5.12 47.66,7.5 JP10.2 | v24.16,73.75 24.03,73.62 v24.03,68.12 | v37.66,67.12 v37.66,73.75 | C5.1 80.53,21.5 77.53,18.5 77.53,16.75 IC18.20 77.41,16.5 77.41,14.5 75.66,12.75 RN2.1 75.41,12.5 75.41,2.62 47.41,2.62 45.66,4.38 45.66,4.62 v45.41,4.88 | 88.28,22.38 88.28,21.75 87.53,21 80.78,21 80.78,21.38 C5.1 | 88.28,22.38 88.28,23.5 87.03,24.75 IC14.5 | 78.53,36.62 80.53,38.62 80.53,40.62 C22.1 | 78.53,36.62 77.53,35.62 IC16.20 | C5.1 80.53,21.75 78.66,23.62 78.66,36.5 78.53,36.62 | R12.2 156.91,16.62 156.91,19 R10.2 | IC8.3 122.41,10.25 125.03,10.25 125.03,10.75 C31.2 | v91.03,22.38 88.28,22.38 | R7.1 101.66,57.75 101.66,52.75 C11.1 | v126.66,52.5 126.66,50.5 126.41,50.25 R9.1 | IC10.14 134.66,89.5 134.66,91.38 C10.1 134.78,91.62 134.78,94.12 137.78,97.12 R16.2 137.66,97.38 137.16,97.88 137.16,118.75 138.91,120.5 IC21.14 139.03,120.75 137.91,121.88 137.91,123.12 C38.1 137.91,123.38 140.91,126.38 140.91,132.5 L1.1 141.03,132.75 141.53,133.25 141.53,138.5 140.41,139.62 C2.1 | IC12.14 156.16,88.38 155.03,89.5 155.03,91.38 C15.1 | IC11.16 168.91,90.88 167.66,92.12 167.66,93.88 C14.1 | R21.1 168.91,133.88 168.91,132.12 R20.1 168.78,131.88 163.28,126.38 163.28,125.75 RN1.1 | C6.1 154.41,128.25 155.53,127.12 155.53,125.75 IC20.18
  Top 0.508: IC17.16 175.16,123.25 174.03,124.38 174.03,126.25 C20.1 174.16,126.5 178.41,130.75 JP1.2 | v195.03,137.38 195.03,147.25 JP11.4 | v108.66,103.38 110.41,105.12 110.41,105.38 R4.1 110.66,105.38 112.28,105.38 R5.1 | C21.1 105.53,123.12 107.28,121.38 107.28,120.75 IC2.14 | v124.16,103.25 126.16,105.25 R6.1 126.41,105.5 127.66,106.75 127.66,116.12 123.28,120.5 IC3.14 123.16,120.75 122.03,121.88 122.03,123.12 C23.1 121.78,123.38 121.41,123.75 121.41,131.25 C30.2 121.41,131.5 122.41,132.5 122.41,135.75 C1.+ 122.66,136 122.66,137.38 127.03,141.75 127.03,142.25 | 123.78,146.38 122.41,145 122.41,142.25 120.53,140.38 IC1.3 | 123.78,146.38 127.03,146.38 127.03,142.25 | 123.78,146.38 123.78,148.25 108.41,148.25 106.03,145.88 106.03,145.5 92.16,145.5 QG1.14 | 127.03,142.25 133.66,142.25 134.78,141.12 X4.5 | IC5.28 197.41,55.25 196.91,55.75 196.91,93.25 196.28,93.88 C17.2 | v89.78,49.88 89.78,46 88.28,44.5 J2.2
  Bottom 0.508: v24.28,141.88 25.78,140.38 29.16,140.38 X2.B3 | v3.16,68.62 5.03,70.5 | 5.03,70.5 8.78,74.25 X1.B29 | v24.16,73.75 28.66,73.75 29.16,74.25 X2.B29 | 23.16,67.25 23.03,67.12 8.41,67.12 5.03,70.5 | 23.16,67.25 v24.03,68.12 | v37.66,73.75 49.03,73.75 49.53,74.25 X3.B29 | v37.66,67.12 23.28,67.12 23.16,67.25 | 45.41,5.12 17.41,5.12 14.53,8 J3.7 | 45.41,5.12 47.53,5.12 JP10.1 | 84.41,40.38 80.91,40.38 80.66,40.62 C22.1 | 84.41,40.38 91.03,40.38 93.28,38.12 C7.1 | J2.2 88.16,44.38 84.41,40.62 84.41,40.38 | 159.41,14 159.91,14.5 161.91,14.5 R15.1 161.91,14.75 161.91,17.12 R14.1 | 159.41,14 156.91,11.5 R1.2 156.66,11.38 154.91,9.62 126.28,9.62 125.28,10.62 C31.2 125.03,10.88 123.16,12.75 105.53,12.75 104.78,13.5 104.78,17.75 | 159.41,14 156.91,16.5 R12.2 | 104.78,17.75 99.91,17.75 R13.1 99.66,17.88 95.41,22.12 94.66,22.12 IC14.15 94.41,22.38 v91.03,22.38 | 104.78,17.75 114.91,17.75 R8.1 | 125.28,53.88 v126.66,52.5 | 125.28,53.88 120.16,53.88 119.03,52.75 106.91,52.75 IC4.8 106.66,52.75 101.66,52.75 C11.1 101.41,52.62 92.53,52.62 v89.78,49.88 | 136.53,59.62 130.91,59.62 126.03,54.75 126.03,54 125.41,54 125.28,53.88 | 136.53,59.62 141.66,59.62 142.78,58.5 C8.1 | IC5.27 197.53,52.75 197.53,55 IC5.28 197.41,55.25 196.16,55.25 192.41,59 C13.1 192.16,59 189.66,56.5 170.41,56.5 170.28,56.38 | 170.28,56.38 169.03,57.62 165.91,57.62 C9.2 165.66,57.75 164.41,56.5 155.03,56.5 154.91,56.38 149.16,56.38 148.03,55.25 IC6.28 147.78,55.38 136.53,55.38 136.53,59.62 | 170.28,56.38 171.41,55.25 IC7.28 | R11.2 148.03,92.62 153.78,92.62 154.91,91.5 C15.1 155.16,91.5 156.41,92.75 166.28,92.75 167.41,93.88 C14.1 167.66,94 175.66,94 C12.1 175.91,93.88 179.16,93.88 182.16,90.88 IC9.16 182.41,91 193.16,91 196.03,93.88 C17.2 196.28,94 196.66,94.38 198.53,94.38 201.28,97.12 IC19.15
  Bottom 0.508: IC10.14 136.66,87.5 147.03,87.5 147.53,87 154.41,87 155.66,88.25 156.16,88.25 IC12.14 | RN1.1 163.16,125.75 155.66,125.75 IC20.18 | 195.03,137.12 185.53,137.12 C3.+ 185.16,137.12 184.78,137.12 180.41,132.75 | 195.03,137.12 196.16,137.12 198.66,134.62 R17.2 | v195.03,137.38 195.03,137.12 | 180.41,132.75 178.53,130.88 JP1.2 | 180.41,132.75 180.28,132.88 169.78,132.88 169.03,132.12 R20.1 168.66,132.12 167.41,130.88 142.78,130.88 141.03,132.62 L1.1 | R3.1 97.16,105.38 99.16,103.38 v108.66,103.38 108.91,103.38 109.03,103.25 v124.16,103.25 | IC2.14 107.41,120.75 108.03,121.38 113.91,121.38 114.53,122 120.78,122 121.91,123.12 C23.1 | C2.1 140.28,139.75 139.03,141 134.91,141 X4.5 | v45.41,4.88 45.41,5.12
A0  (via drill 0.66)
  Top 0.254: IC18.38 33.28,32.75 33.28,49.75 34.28,50.75 IC16.38 34.28,50.88 34.28,69.12 X2.A31 | v157.28,99.75 153.03,104 153.03,111.5 147.41,111.5 146.28,112.62 146.28,119 147.91,120.62 IC20.3 | v113.91,49.75 118.03,45.62 118.03,42.75 119.03,41.75 119.03,33.75 v118.66,33.38 | IC19.13 186.16,99.62 187.28,98.5 187.28,60.5 186.16,59.38 186.16,36.38 182.28,32.5 IC5.10 | v104.53,69.88 104.91,69.5 104.91,52 106.66,50.25 IC4.9
  Bottom 0.254: X1.A31 14.03,69.25 14.78,70 27.66,70 28.16,70.5 32.41,70.5 33.66,69.25 34.28,69.25 X2.A31 34.41,69.25 34.91,69.25 36.16,70.5 50.53,70.5 51.03,70 53.78,70 54.53,69.25 X3.A31 54.66,69.25 55.28,69.88 v104.53,69.88 | v157.28,99.75 186.03,99.75 IC19.13 | v113.91,49.75 107.16,49.75 106.78,50.12 IC4.9 | v118.66,33.38 131.41,33.38 132.28,32.5 132.66,32.5 IC6.10 132.78,32.38 133.78,31.38 149.03,31.38 149.41,31.75 155.53,31.75 156.16,32.38 IC7.10 156.28,32.38 167.66,32.38 168.66,31.38 172.53,31.38 173.16,32 181.78,32 182.16,32.38 IC5.10
A1  (via drill 0.66)
  Top 0.254: IC19.14 186.03,97.12 185.66,96.75 185.66,38.38 182.28,35 IC5.9 | IC18.37 36.91,31.75 37.91,32.75 37.91,49.75 36.91,50.75 IC16.37 36.78,50.88 34.91,52.75 34.91,67.5 35.53,68.12 35.53,70.62 34.41,71.75 X2.A30 | v108.41,71.5 108.41,49.25 106.78,47.62 IC4.10 | v134.41,41 134.41,36.62 132.78,35 IC6.9 | v109.78,41.62 109.41,42 v109.41,45.75
  Bottom 0.254: IC6.9 132.78,34.88 133.28,34.38 146.41,34.38 146.91,33.88 154.78,33.88 155.78,34.88 156.16,34.88 IC7.9 156.28,34.88 157.03,34.88 158.03,33.88 172.53,33.88 172.66,34 181.28,34 182.16,34.88 IC5.9 | X1.A30 14.03,71.75 26.91,71.75 28.16,73 32.28,73 33.41,71.88 34.28,71.88 X2.A30 34.41,71.88 35.03,72.5 47.91,72.5 48.41,73 52.53,73 53.66,71.88 54.53,71.88 X3.A30 54.66,71.75 55.28,71.12 71.66,71.12 72.78,72.25 107.66,72.25 v108.41,71.5 | v134.41,41 112.16,41 111.66,40.5 110.91,40.5 v109.78,41.62 | v109.41,45.75 107.53,47.62 IC4.10
A2  (via drill 0.66)
  Top 0.254: v115.16,44.88 118.16,41.88 v118.16,39.12 | IC18.36 39.41,31.75 40.41,32.75 40.41,49.75 39.41,50.75 IC16.36 39.41,50.88 v39.41,66 | v15.53,66 15.53,72.75 14.03,74.25 X1.A29 | v32.78,66 33.03,66.25 33.03,73 34.28,74.25 X2.A29 | X3.A29 54.53,74.25 50.78,70.5 v50.78,66.12 50.78,66 50.16,65.38 50.16,55.75 v53.03,52.88
  Bottom 0.254: v115.16,44.88 106.91,44.88 106.78,45 IC4.11 106.66,45.12 105.16,46.62 93.91,46.62 92.16,48.38 60.03,48.38 58.16,50.25 58.16,52.88 v53.03,52.88 | v118.16,39.12 118.78,38.5 130.28,38.5 131.28,37.5 132.66,37.5 IC6.8 132.78,37.5 133.78,38.5 155.16,38.5 155.22,38.44 | 155.22,38.44 156.16,37.5 IC7.8 | IC5.8 182.16,37.5 181.16,38.5 155.28,38.5 155.22,38.44 | v15.53,66 15.91,66.38 32.41,66.38 v32.78,66 32.66,66.25 37.03,66.25 37.16,66.12 39.41,66.12 | 39.41,66.12 v50.78,66.12 | v39.41,66 39.41,66.12
A3  (via drill 0.66)
  Top 0.254: IC18.35 40.91,32.75 40.91,45.38 43.53,48 v43.53,48.12 42.03,49.62 42.03,50.75 IC16.35 42.03,50.88 46.66,55.5 v46.66,77.62 | v135.28,46 v135.28,42.75 | v114.66,46.12 113.91,45.38 v113.91,43.12
  Bottom 0.254: 135.28,40.12 145.91,40.12 146.78,41 155.28,41 | 135.28,40.12 132.78,40.12 IC6.7 | 155.28,41 156.16,40.12 IC7.7 | 155.28,41 181.28,41 182.16,40.12 IC5.7 | X1.A28 14.03,76.88 14.78,77.62 27.66,77.62 28.16,78.12 32.28,78.12 33.53,76.88 34.28,76.88 X2.A28 34.41,76.88 36.66,76.88 37.91,78.12 46.66,78.12 | 46.66,78.12 53.28,78.12 54.53,76.88 X3.A28 | v43.53,48.12 44.91,46.75 67.53,46.75 68.28,46 76.03,46 76.78,46.75 81.03,46.75 81.16,46.62 91.91,46.62 92.41,46.12 103.16,46.12 106.66,42.62 IC4.12 106.78,42.5 113.28,42.5 v113.91,43.12 | v46.66,77.62 46.66,78.12 | v135.28,42.75 135.28,40.12 | v135.28,46 135.16,46.12 129.66,46.12 129.28,45.75 123.41,45.75 123.03,46.12 v114.66,46.12
A4  (via drill 0.66)
  Top 0.254: v16.41,65 16.41,77 14.03,79.38 X1.A27 | v31.53,65.5 31.91,65.88 31.91,68.12 32.53,68.75 32.53,77.62 X2.A27 | X3.A27 50.78,79.38 50.78,80.5 50.66,80.62 46.66,80.62 v46.66,81.75 | v131.03,39 131.03,40.88 132.66,42.5 IC6.6 | v86.03,77.25 92.66,70.62 92.66,68.38 95.41,65.62 95.41,44 v95.03,43.62
  Bottom 0.254: v16.41,65 17.28,65.88 31.16,65.88 v31.53,65.5 | v46.66,81.75 46.28,81.38 36.78,81.38 34.78,79.38 X2.A27 | v131.03,39 120.78,39 119.78,40 106.78,40 IC4.13 106.66,40.12 98.53,40.12 v95.03,43.62 | IC6.6 132.78,42.62 133.78,43.62 149.03,43.62 149.16,43.5 155.28,43.5 156.16,42.62 IC7.6 156.28,42.62 156.66,42.62 157.66,43.62 172.53,43.62 172.66,43.5 181.28,43.5 182.16,42.62 IC5.6 | v86.03,77.25 56.78,77.25 54.66,79.38 X3.A27
A5  (via drill 0.66)
  Top 0.254: v18.66,65 18.66,77.25 14.03,81.88 X1.A26 | v30.28,65 30.66,65.38 30.66,67.62 31.78,68.75 31.78,79.38 34.28,81.88 X2.A26 | v47.78,84.5 47.78,85.75 50.78,85.75 54.53,82 X3.A26 | IC4.14 106.78,37.5 108.53,39.25 v108.53,43.38 108.53,46.12 110.28,47.88 110.28,76.25 v104.03,82.5
  Bottom 0.254: v18.66,65 19.03,65.38 29.91,65.38 v30.28,65 | v47.78,84.5 47.03,83.75 36.16,83.75 34.41,82 X2.A26 | v108.53,43.38 109.16,44 129.66,44 130.66,45 132.66,45 IC6.5 132.78,45.12 135.66,45.12 136.66,46.12 155.16,46.12 155.22,46.06 | 155.22,46.06 156.16,45.12 IC7.5 | IC5.5 182.16,45.12 181.16,46.12 155.28,46.12 155.22,46.06 | v104.03,82.5 102.91,83.62 56.28,83.62 54.66,82 X3.A26
A6  (via drill 0.66)
  Top 0.254: v131.03,44.12 131.03,46 132.66,47.62 IC6.4 | IC4.15 106.78,35 111.28,39.5 v111.28,41.38 111.28,41.5 111.66,41.88 111.66,62.12 111.28,62.5 111.28,78.5 v105.66,84.12
  Bottom 0.254: X1.A25 14.03,84.5 14.41,84.88 27.28,84.88 28.16,85.75 32.28,85.75 33.53,84.5 34.28,84.5 X2.A25 34.41,84.5 46.53,84.5 47.78,85.75 50.53,85.75 51.41,84.88 54.16,84.88 54.53,84.5 X3.A25 54.66,84.38 54.91,84.12 v105.66,84.12 | v111.28,41.38 111.41,41.5 128.41,41.5 v131.03,44.12 | 155.22,48.56 155.16,48.62 135.16,48.62 134.16,47.62 IC6.4 | 155.22,48.56 156.16,47.62 IC7.4 | IC5.4 182.16,47.62 181.16,48.62 155.28,48.62 155.22,48.56
A7  (via drill 0.66)
  Top 0.254: v26.53,90.38 27.41,89.5 v27.41,64.5 | v36.66,65.38 36.66,76.88 37.16,77.38 37.16,85.75 36.03,86.88 34.41,86.88 X2.A24 | v69.53,86.88 69.53,65.12 | 69.53,65.12 69.53,51.12 69.78,50.88 IC16.24 | v69.41,65.12 69.53,65.12 | IC10.4 128.28,80.62 128.28,78.12 IC10.5 128.28,78 130.53,75.75 130.53,64.38 | v129.78,34.5 130.16,34.88 130.16,47.62 132.66,50.12 IC6.3 132.66,50.25 130.53,52.38 130.53,64.38 | v130.41,64.38 130.53,64.38
  Bottom 0.254: v26.53,90.38 20.78,90.38 18.16,87.75 14.78,87.75 14.03,87 X1.A24 | v27.41,64.5 27.78,64.12 35.41,64.12 v36.66,65.38 36.78,65.38 37.03,65.12 v69.41,65.12 69.53,65.12 70.28,64.38 v130.41,64.38 | v69.53,86.88 54.66,86.88 X3.A24 | v129.78,34.5 129.16,33.88 120.91,33.88 120.53,34.25 118.28,34.25 117.03,33 107.28,33 106.78,32.5 IC4.16 | 155.22,49.19 155.16,49.12 135.16,49.12 134.16,50.12 132.78,50.12 IC6.3 | 155.22,49.19 156.16,50.12 IC7.3 | IC5.3 182.16,50.12 181.16,49.12 155.28,49.12 155.22,49.19
A8  (via drill 0.66)
  Top 0.254: v36.66,63.62 38.53,65.5 38.53,66.62 38.66,66.75 38.66,78.62 37.66,79.62 37.66,86.25 36.09,87.81 | 36.09,87.81 34.41,89.5 X2.A23 | v46.66,91.25 46.66,93.38 50.78,93.38 54.53,89.62 X3.A23 | 36.09,87.81 v37.03,88.75 | v128.91,46.62 v128.91,31.62 | IC9.14 182.16,85.62 179.78,83.25 179.78,79.75 178.53,78.5 178.53,54.62 171.53,47.62 IC7.25 | v89.66,90.25 103.66,76.25 103.66,47.75 105.03,46.38 105.03,31.5 106.66,29.88 IC4.17
  Bottom 0.254: v36.66,63.62 2.16,63.62 2.16,87.62 7.91,93.38 10.16,93.38 13.91,89.62 X1.A23 | v46.66,91.25 44.16,88.75 v37.03,88.75 | v128.91,31.62 125.28,31.62 124.53,30.88 107.78,30.88 106.78,29.88 IC4.17 | v128.91,46.62 134.66,46.62 135.66,47.62 IC6.25 148.03,47.62 149.03,46.62 170.41,46.62 170.47,46.69 | 170.47,46.69 171.41,47.62 IC7.25 | IC5.25 197.41,47.62 196.41,46.62 170.53,46.62 170.47,46.69 | v89.66,90.25 55.28,90.25 54.66,89.62 X3.A23
A9  (via drill 0.66)
  Top 0.254: v112.16,21.88 106.78,27.25 IC4.18 106.78,27.38 112.16,32.75 112.16,57.62 114.03,59.5 114.03,83.38 v106.28,91.12 | v142.66,21.12 143.66,22.12 143.66,40.75 147.91,45 IC6.24 | IC9.13 182.16,83.12 180.28,81.25 180.28,79.5 179.03,78.25 179.03,52.62 171.53,45.12 IC7.24
  Bottom 0.254: X1.A22 14.03,92.12 14.41,92.5 27.28,92.5 28.16,93.38 32.41,93.38 33.66,92.12 34.28,92.12 X2.A22 34.41,92.12 34.91,92.12 36.16,93.38 53.28,93.38 54.53,92.12 X3.A22 54.66,92 55.53,91.12 v106.28,91.12 | v112.16,21.88 112.91,21.12 v142.66,21.12 | IC6.24 148.03,45 148.41,45 149.41,44 157.28,44 157.41,44.12 170.53,44.12 171.41,45 IC7.24 171.53,45 171.91,45 172.91,44 196.41,44 197.41,45 IC5.24
A10  (via drill 0.66)
  Top 0.254: v23.91,98 25.66,96.25 25.66,64.5 v27.41,62.75 | v35.78,62.62 35.78,67.62 36.16,68 36.16,77.62 v36.28,77.75 | v38.53,80 38.16,80.38 38.16,90.75 X2.A21 | v46.66,98 46.66,95.88 50.66,95.88 51.03,95.5 51.03,94.62 54.53,94.62 X3.A21 | v137.66,30 138.28,30.62 v138.28,36.25 | v199.78,72.88 199.78,39.75 197.53,37.5 IC5.21 | v86.03,92.62 93.16,85.5 93.16,68.62 95.91,65.88 95.91,23.25 98.03,21.12 108.41,21.12 108.41,23.12 106.78,24.75 IC4.19
  Bottom 0.254: v23.91,98 19.16,98 16.53,95.38 14.78,95.38 14.03,94.62 X1.A21 | v27.41,62.75 27.53,62.62 v35.78,62.62 | v38.53,80 v36.28,77.75 | v46.66,98 46.28,97.62 37.78,97.62 34.78,94.62 34.41,94.62 X2.A21 | v137.66,30 136.41,30 135.16,28.75 110.66,28.75 106.78,24.88 IC4.19 | v138.28,36.25 139.41,37.38 147.91,37.38 IC6.21 148.03,37.38 149.03,36.38 170.41,36.38 170.47,36.44 | 170.47,36.44 171.41,37.38 IC7.21 | IC5.21 197.41,37.38 196.41,36.38 170.53,36.38 170.47,36.44 | v199.78,72.88 183.28,89.38 175.66,89.38 174.66,88.38 IC9.2 | v86.03,92.62 56.53,92.62 54.66,94.5 X3.A21
A11  (via drill 0.66)
  Top 0.254: v18.66,95.5 18.66,97.12 14.03,97.12 X1.A20 | v23.91,94.75 25.16,93.5 v25.16,62.75 | v40.28,63.25 40.28,93.25 36.41,97.12 34.41,97.12 X2.A20 | v51.03,63.25 55.91,68.12 55.91,95.88 54.66,97.12 X3.A20 | v143.66,20.25 144.16,20.75 144.16,38.75 147.91,42.5 IC6.23 | v195.78,71.75 195.78,44.25 IC5.23 | v99.16,56.88 100.53,55.5 100.53,50.12 104.53,46.12 104.53,24.38 IC4.20
  Bottom 0.254: v18.66,95.5 19.41,94.75 v23.91,94.75 | v25.16,62.75 26.41,61.5 38.53,61.5 v40.28,63.25 v51.03,63.25 51.16,63.25 57.53,56.88 v99.16,56.88 | IC4.20 108.66,20.25 v143.66,20.25 | 170.47,41.56 170.41,41.5 149.03,41.5 148.03,42.5 IC6.23 | 170.47,41.56 IC7.23 | IC5.23 197.41,42.5 196.41,41.5 170.53,41.5 170.47,41.56 | v195.78,71.75 183.28,84.25 181.66,84.25 181.16,84.75 175.53,84.75 174.66,85.62 IC9.3
A12  (via drill 0.66)
  Top 0.254: v137.16,23.75 136.78,24.12 136.78,48.62 132.78,52.62 IC6.2 132.66,52.75 131.03,54.38 131.03,55.62 131.28,55.88 131.28,87.38 128.53,90.12 128.53,94.5 v126.28,96.75 | v184.28,78.62 183.91,78.25 183.91,54.38 182.28,52.75 IC5.2
  Bottom 0.254: X1.A19 14.03,99.75 14.78,100.5 27.66,100.5 28.16,101 32.28,101 33.53,99.75 34.28,99.75 X2.A19 34.41,99.75 34.91,99.75 36.16,101 53.28,101 54.53,99.75 X3.A19 54.66,99.62 57.53,96.75 v126.28,96.75 | v137.16,23.75 123.03,23.75 122.03,24.75 IC4.22 | 155.22,53.69 155.16,53.75 134.66,53.75 133.66,52.75 132.78,52.75 IC6.2 | 155.22,53.69 156.16,52.75 IC7.2 | IC5.2 182.16,52.75 181.16,53.75 155.28,53.75 155.22,53.69 | v184.28,78.62 183.78,79.12 180.53,79.12 180.53,80.38 179.16,81.75 172.91,81.75 169.03,85.62 IC11.14
A13  (via drill 0.66)
  Top 0.254: v124.03,49.38 124.16,49.25 124.16,29.5 122.03,27.38 IC4.23 | v25.28,102.12 27.91,102.12 27.91,101.25 28.16,101 32.53,101 33.66,102.12 34.28,102.12 X2.A18 34.41,102.25 36.53,102.25 36.53,107 v38.03,108.5 | IC7.26 171.53,50.25 173.28,52 173.28,72.25 172.91,72.62 172.91,78.25 171.53,79.62 167.16,79.62 167.16,81.38 168.91,83.12 IC11.13 | v146.03,98.25 146.91,97.38 146.91,92.12 150.28,88.75 150.28,82.38 | 150.28,82.38 148.66,80.75 IC12.4 | v39.78,120.88 v39.78,109 | v56.28,121.25 56.41,121.12 56.41,103.25 55.41,102.25 54.66,102.25 X3.A18 | 150.28,82.38 150.28,72.62 146.16,68.5 146.16,52 147.91,50.25 IC6.26
  Bottom 0.254: v124.03,49.38 126.16,51.5 146.66,51.5 147.91,50.25 IC6.26 | v25.28,102.12 14.03,102.12 X1.A18 | IC12.4 148.66,80.62 149.66,79.62 170.03,79.62 170.66,80.25 170.66,83.12 169.03,83.12 IC11.13 | v146.03,98.25 137.41,98.25 137.28,98.12 58.66,98.12 54.66,102.12 X3.A18 | v38.03,108.5 38.53,109 v39.78,109 | v39.78,120.88 40.16,121.25 v56.28,121.25
A14  (via drill 0.66)
  Top 0.254: v22.78,108.12 23.03,107.88 v23.03,60.62 | v43.16,62.38 44.03,63.25 44.03,67 | 44.03,106.12 44.03,106.5 45.78,108.25 45.78,110 46.91,111.12 51.03,111.12 51.03,108.38 54.53,104.88 X3.A17 | 44.03,106.12 44.03,67 | 44.03,106.12 v43.16,106.12 | v125.03,30.12 124.91,30.25 124.91,52.12 v127.91,55.12 | v158.91,67.88 158.91,85.88 161.28,88.25 IC11.2 | v137.91,66.75 132.78,61.62 132.78,55.25 IC6.1 | v43.91,67 44.03,67
  Bottom 0.254: v22.78,108.12 22.53,107.88 17.03,107.88 14.03,104.88 X1.A17 | v23.03,60.62 23.78,59.88 40.66,59.88 v43.16,62.38 | v43.16,106.12 42.78,105.75 35.28,105.75 34.41,104.88 X2.A17 | v125.03,30.12 122.28,30.12 122.03,29.88 IC4.24 | v127.91,55.12 132.66,55.12 IC6.1 | v158.91,67.88 157.78,66.75 v137.91,66.75 121.03,66.75 118.78,69 101.16,69 99.53,67.38 68.28,67.38 67.91,67 v43.91,67
A15  (via drill 0.66)
  Top 0.254: v130.66,32.5 132.03,33.88 135.41,33.88 v135.41,35.75 | v154.53,84.25 152.91,82.62 152.91,39.88 IC6.20 | v20.91,108.75 22.16,107.5 v22.16,62.75 | v40.28,60.75 41.16,61.62 41.16,64.12 | 41.16,64.12 41.16,102.88 v37.41,106.62 | v43.66,107.38 43.66,108.62 47.16,112.12 47.16,118.75 50.53,118.75 51.53,117.75 51.53,110.38 54.53,107.38 X3.A16 | v97.41,31.38 96.78,32 v96.78,62 | v41.28,64.12 41.16,64.12
  Bottom 0.254: v130.66,32.5 122.03,32.5 IC4.25 121.91,32.38 121.41,31.88 108.28,31.88 107.78,31.38 v97.41,31.38 | v135.41,35.75 135.78,35.38 147.53,35.38 147.91,35 IC6.20 | v154.53,84.25 159.91,84.25 161.28,85.62 IC11.3 | X1.A16 15.03,108.38 20.53,108.38 v20.91,108.75 | v22.16,62.75 24.16,60.75 v40.28,60.75 | X2.A16 34.41,107.25 36.78,107.25 v37.41,106.62 37.16,107 43.28,107 v43.66,107.38 | v96.78,62 94.91,63.88 57.53,63.88 57.28,64.12 v41.28,64.12
ACIA_CSH
  Top 0.254: R17.1 188.53,134.5 187.28,133.25 187.28,128.88 186.16,127.75 IC19.2
AVR_RST
  Top 0.254: IC14.10 87.03,12.12 92.03,17.12 92.03,40.62 93.28,41.88 J2.5
BE  (via drill 0.66)
  Top 0.254: v18.66,57.62 12.66,63.62 12.66,69.38 10.66,71.38 10.66,116.75 13.91,120 X1.A11 | v68.16,55.5 68.53,55.88 68.53,66.5 | 68.53,66.5 68.53,114.62 v63.53,119.62 | v37.53,118.88 36.91,119.5 36.91,120 34.41,120 X2.A11 | v46.28,119.12 48.41,121.25 54.53,121.25 54.53,120.12 X3.A11 | v119.41,65.25 119.41,62.88 121.91,60.38 IC4.36 | v68.66,66.5 68.53,66.5
  Bottom 0.254: IC4.36 122.03,60.38 126.28,60.38 R9.2 | v18.66,57.62 22.03,54.25 66.91,54.25 v68.16,55.5 | v63.53,119.62 63.16,120 54.66,120 X3.A11 | v37.53,118.88 37.78,119.12 v46.28,119.12 | v119.41,65.25 118.16,66.5 v68.66,66.5
C-F
  Top 0.254: IC12.3 146.91,81.5 146.91,79.75 148.53,78.12 IC12.5
CA1
  Bottom 0.254: IC16.40 29.16,50.88 28.53,51.5 13.28,51.5 7.66,57.12 JP9.1
CA2  (via drill 0.66)
  Top 0.254: v24.41,58.12 31.66,50.88 IC16.39
  Bottom 0.254: v24.41,58.12 24.03,58.5 16.03,58.5 14.53,60 7.91,60 7.66,59.75 JP9.3
CB1  (via drill 0.66)
  Top 0.254: v66.91,26.62 70.91,30.62 70.91,32.38 71.78,33.25 71.78,35 72.28,35.5 IC16.18
  Bottom 0.254: v66.91,26.62 5.91,26.62 3.41,29.12 3.41,60.88 5.53,60.88 6.28,60.12 6.28,57.25 5.16,57.25 JP9.2
CB2  (via drill 0.66)
  Top 0.254: v74.78,38.75 74.78,35.75 74.91,35.62 IC16.19
  Bottom 0.254: v74.78,38.75 67.28,46.25 4.91,46.25 3.91,47.25 3.91,59.62 5.03,59.62 JP9.4
CLK  (via drill 0.66)
  Top 0.254: v113.16,63.5 111.78,64.88 111.78,84.38 108.22,87.94 | 108.22,87.94 103.16,93 103.16,117.75 103.78,118.38 103.78,125.12 108.03,129.38 111.03,129.38 111.03,128.38 JP13.1 | v104.53,71.38 104.16,71.75 104.16,81.12 103.16,82.12 103.16,82.88 108.22,87.94
  Bottom 0.254: X1.B30 8.91,71.75 10.16,70.5 27.41,70.5 28.66,71.75 29.16,71.75 X2.B30 29.28,71.75 31.91,71.75 33.16,70.5 35.41,70.5 35.91,71 48.78,71 X3.B30 49.66,71.75 50.41,71 53.03,71 53.53,70.5 103.66,70.5 v104.53,71.38 | v113.16,63.5 121.28,63.5 121.91,62.88 IC4.37
CS_1  (via drill 0.66)
  Top 0.254: 28.28,59 24.03,59 23.53,58.5 23.53,52.88 19.16,52.88 10.78,61.25 10.78,70.5 7.78,70.5 7.53,70.75 7.53,78.12 8.78,79.38 X1.B27 | 28.28,59 28.28,67.88 27.91,68.25 27.91,78.12 29.16,79.38 X2.B27 | X3.B27 47.53,77.38 v47.53,62.38 | v29.28,58.12 28.41,59 28.28,59
  Bottom 0.254: v47.53,62.38 43.28,58.12 v29.28,58.12
CS_2
  Bottom 0.254: X1.B26 8.91,81.88 12.66,78.12 25.41,78.12 29.16,81.88 X2.B26 29.28,81.88 33.03,78.12 35.41,78.12 38.16,80.88 48.53,80.88 49.53,81.88 X3.B26
CTS  (via drill 0.66)
  Top 0.254: JP11.7 202.53,147.25 198.66,143.38 198.66,142.25 197.53,141.12 SJ2.2 197.78,141.25 198.66,140.38 198.66,136 191.91,129.25 v191.91,115.25 | JP12.2 181.03,105.5 185.28,109.75 186.03,109.75 IC19.9
  Bottom 0.254: v191.91,115.25 186.53,109.88 186.16,109.88 IC19.9
D0  (via drill 0.66)
  Top 0.254: IC18.33 47.03,31.75 48.03,32.75 48.03,49.75 47.03,50.75 IC16.33 | v130.03,50.62 130.03,56.12 124.78,56.12 124.03,55.38 124.03,54.75 122.03,52.75 IC4.33 | v134.16,48.88 136.28,46.75 136.28,33.38 132.78,29.88 IC6.11 | v91.78,47.5 v94.03,49.75 94.03,49.88 85.16,58.75 85.16,102.38 | 85.16,102.38 v85.16,119.62 | 85.16,102.38 v89.28,102.38
  Bottom 0.254: 153.03,103.38 153.03,104.75 153.53,105.25 155.41,105.25 155.53,105.38 IC20.10 | 153.03,103.38 199.91,103.38 201.28,104.75 IC19.18 | X1.A9 14.03,125.12 14.16,125.25 20.03,125.25 21.16,126.38 32.28,126.38 33.53,125.12 34.28,125.12 X2.A9 34.41,125.12 34.91,125.12 36.16,126.38 53.28,126.38 54.53,125.12 X3.A9 54.66,125 56.66,123 81.78,123 v85.16,119.62 | v130.03,50.62 131.78,48.88 v134.16,48.88 | IC6.11 132.78,29.88 133.78,30.88 149.03,30.88 149.91,30 156.03,30 156.16,29.88 IC7.11 156.28,29.88 167.66,29.88 168.66,30.88 172.53,30.88 173.16,30.25 181.78,30.25 182.16,29.88 IC5.11 | v91.78,47.5 91.53,47.75 50.03,47.75 47.03,50.75 IC16.33 | v94.03,49.75 95.91,51.62 120.53,51.62 121.53,52.62 121.91,52.62 IC4.33 | v89.28,102.38 89.41,102.25 151.78,102.25 152.91,103.38 153.03,103.38
D1  (via drill 0.66)
  Top 0.254: IC18.32 48.53,32.75 48.53,49.75 49.53,50.75 IC16.32 49.53,50.88 47.53,52.88 v47.53,56.75 | v26.16,128.38 28.16,126.38 32.53,126.38 33.78,127.62 X2.A8 34.41,127.75 v38.03,127.75 40.91,127.75 42.41,126.25 42.41,120.88 42.28,120.75 42.28,62 v45.41,58.88 | v159.66,102.5 159.66,103.88 155.66,107.88 IC20.11 | v125.78,47.62 125.41,47.25 125.41,31 128.53,27.88 v128.53,27.38 | v189.28,94.88 189.03,94.62 189.03,34.12 182.28,27.38 IC5.12 | v114.91,54.62 117.66,51.88 v117.66,48.5